# Altium project testrack_module_breakout.PrjPcb
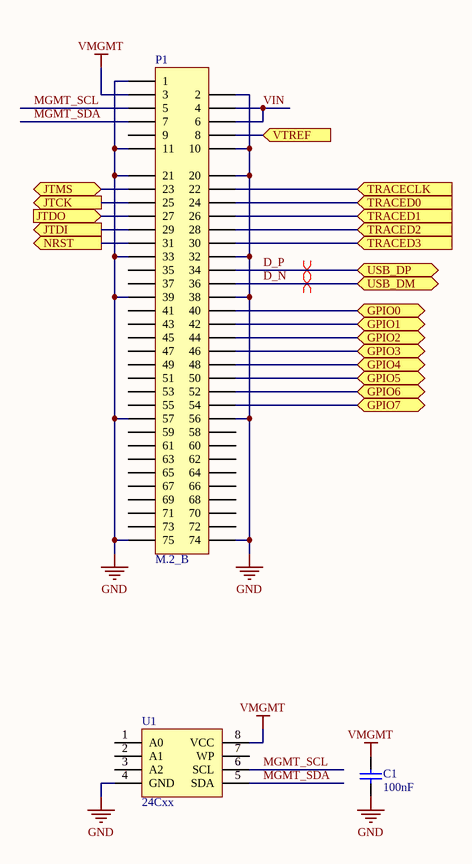
[diagram p0: edge.SchDoc]
2 sheets, 3 parts. Net scope: flat (ports and power ports of the same name join across sheets).
Board file: testrack_module_breakout.PcbDoc
Sheets:
  edge.SchDoc
  connectors.SchDoc

## Sheet edge.SchDoc
size A

### Parts
C1  100nF  [0402]
P1  M.2_B  [M.2_B_EDGE]
U1  24Cxx  [SO8]

### Ports
GPIO0 (bidir), GPIO1 (bidir), GPIO2 (bidir), GPIO3 (bidir), GPIO4 (bidir), GPIO5 (bidir), GPIO6 (bidir), GPIO7 (bidir), JTCK (out), JTDI (out), JTDO (in), JTMS (bidir), NRST (out), TRACECLK (in), TRACED0 (in), TRACED1 (in), TRACED2 (in), TRACED3 (in), USB_DM (bidir), USB_DP (bidir), VTREF (in)

### Nets
GND: C1.1 P1.1 P1.2 P1.10 P1.11 P1.20 P1.21 P1.32 P1.33 P1.38 P1.39 P1.56 P1.57 P1.74 P1.75 U1.4(GND)
VMGMT: C1.2 P1.3 U1.8(VCC)
D_N: P1.36 ; port USB_DM
D_P: P1.34 ; port USB_DP
GPIO0: P1.40 ; port GPIO0
GPIO1: P1.42 ; port GPIO1
GPIO2: P1.44 ; port GPIO2
GPIO3: P1.46 ; port GPIO3
GPIO4: P1.48 ; port GPIO4
GPIO5: P1.50 ; port GPIO5
GPIO6: P1.52 ; port GPIO6
GPIO7: P1.54 ; port GPIO7
JTCK: P1.25 ; port JTCK
JTDI: P1.29 ; port JTDI
JTDO: P1.27 ; port JTDO
JTMS: P1.23 ; port JTMS
MGMT_SCL: P1.5 U1.6(SCL)
MGMT_SDA: P1.7 U1.5(SDA)
NRST: P1.31 ; port NRST
TRACECLK: P1.22 ; port TRACECLK
TRACED0: P1.24 ; port TRACED0
TRACED1: P1.26 ; port TRACED1
TRACED2: P1.28 ; port TRACED2
TRACED3: P1.30 ; port TRACED3
VIN: P1.4 P1.6
VTREF: P1.8 ; port VTREF

Not connected (* = marked no-connect by the designer): P1 9 35 37 41 43 45 47 49 51 53 55 58 59 60 61 62 63 64 65 66 67 68 69 70 71 72 73; U1 1(A0) 2(A1) 3(A2) 7(WP)

### Layout directives
differential pair: D_N, D_P

### Library data of the parts
C1 = Capacitor: Value: 100nF

## Sheet connectors.SchDoc
size A